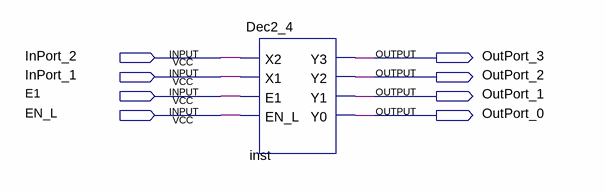
[diagram p0: schematic sheet]
// Quartus schematic DecoderDemo.bdf as structural Verilog: 1 symbols, 8 pins
module DecoderDemo (
  input  InPort_2,
  input  InPort_1,
  input  E1,
  input  EN_L,
  output OutPort_3,
  output OutPort_2,
  output OutPort_1,
  output OutPort_0
);

  Dec2_4 inst (
    .X2(InPort_2), .X1(InPort_1), .E1(E1), .EN_L(EN_L), .Y3(OutPort_3), .Y2(OutPort_2), .Y1(OutPort_1),
    .Y0(OutPort_0));
endmodule
